# Altium schematic sheet Power.SchDoc
size A3; SheetNumber: 2; SheetTotal: 5
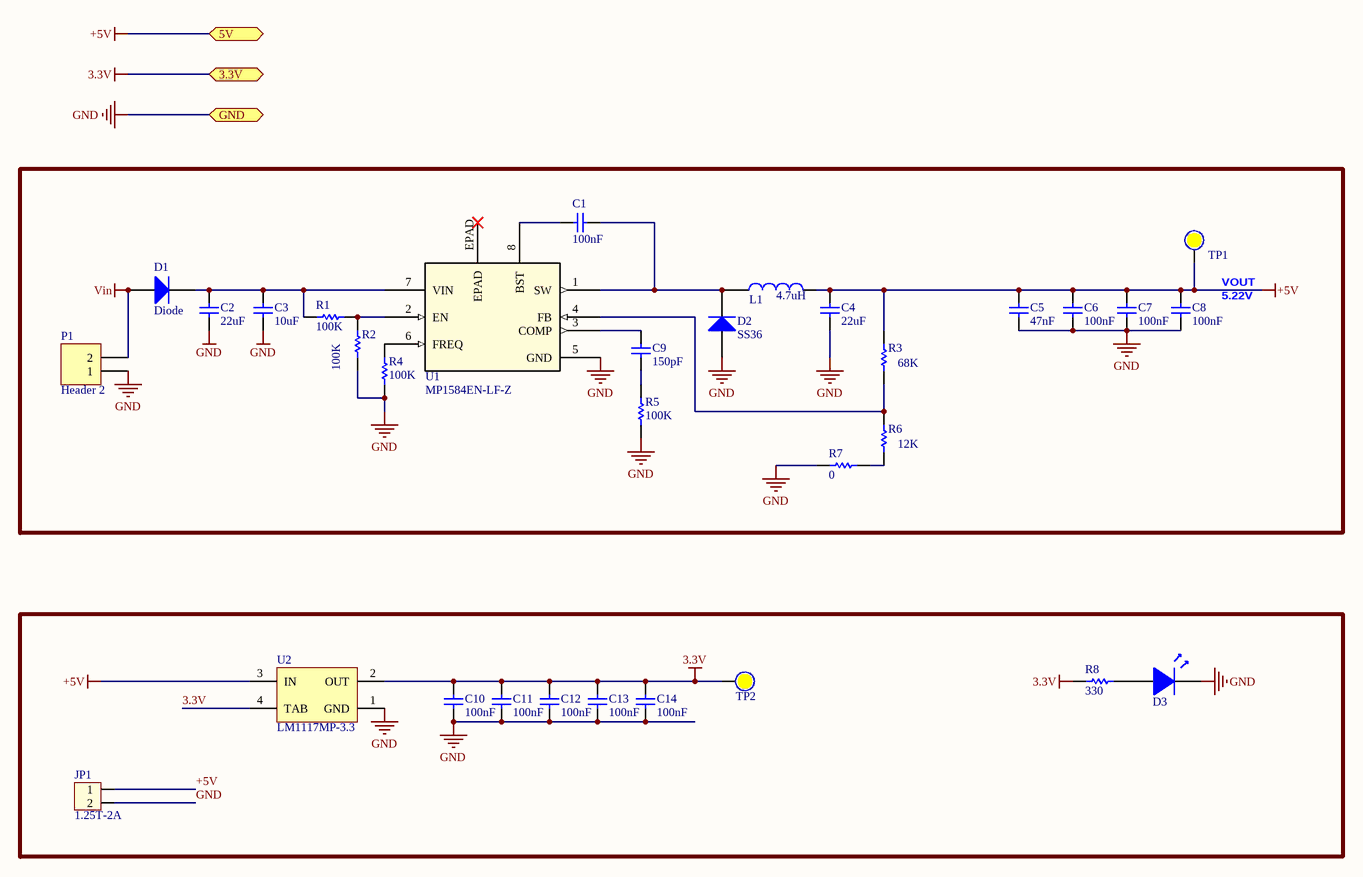
[diagram p0: Power.SchDoc]

## Parts
C1  100nF  [CAPC-0402 (0506)]
C2  22uF  [2012[0805]]
C3  10uF  [2012[0805]]
C4  22uF  [2012[0805]]
C5  47nF  [2012[0805]]
C6  100nF  [CAPC-0402 (0506)]
C7  100nF  [CAPC-0402 (0506)]
C8  100nF  [CAPC-0402 (0506)]
C9  150pF  [1005[0402]]
C10  100nF  [CAPC-0402 (0506)]
C11  100nF  [CAPC-0402 (0506)]
C12  100nF  [CAPC-0402 (0506)]
C13  100nF  [CAPC-0402 (0506)]
C14  100nF  [CAPC-0402 (0506)]
D1  Diode  [DIODE SMD]
D2  SS36  [SMB]
D3  LED  [LED_0603_BLUE]  (value not drawn)
JP1  1.25T-2A  [BM02B-GHS]
L1  4.7uH  [INDUCTOR SMD 7x7]
P1  Header 2  [BM02B-GHS]
R1  100K  [1005[0402]]
R2  100K  [1005[0402]]
R3  68K  [1005[0402]]
R4  100K  [1005[0402]]
R5  100K  [1005[0402]]
R6  12K  [1005[0402]]
R7  0  [1005[0402]]
R8  330  [RESC-0402 (1005)]
TP1  (no value)  [Test Point 1 MM]  (no BOM)
TP2  (no value)  [Test Point 1 MM]  (no BOM)
U1  MP1584EN-LF-Z  [SOIC8E_MPS]
U2  LM1117MP-3.3  [MP04A_N]

## Ports
3.3V (bidir), 5V (bidir), GND (bidir)

## Nets
3.3V: C10.2 C11.2 C12.2 C13.2 C14.2 R8.2 TP2.0 U2.2(OUT) U2.4(TAB) ; port 3.3V
+5V: C4.2 C5.2 C6.2 C7.2 C8.2 JP1.1 L1.2 R3.2 TP1.0 U2.3(IN) ; port 5V
GND: C2.1 C3.1 C4.1 C5.1 C6.1 C7.1 C8.1 C10.1 C11.1 C12.1 C13.1 C14.1 D2.1(A) D3.2(K) JP1.2 P1.1 R2.1 R4.2 R5.2 R7.1 U1.5(GND) U2.1(GND) ; port GND
Vin: D1.1(A) P1.2
NetC1_1: C1.1 D2.2(K) L1.1 U1.1(SW)
NetC1_2: C1.2 U1.8(BST)
NetC2_2: C2.2 C3.2 D1.2(K) R1.2 U1.7(VIN)
NetC9_1: C9.1 R5.1
NetC9_2: C9.2 U1.3(COMP)
NetD3_1: D3.1(A) R8.1
NetR1_1: R1.1 R2.2 U1.2(EN)
NetR3_1: R3.1 R6.1 U1.4(FB)
NetR4_1: R4.1 U1.6(FREQ)
NetR6_2: R6.2 R7.2

Not connected (* = marked no-connect by the designer): U1 EPAD*

## Notes on the sheet
- 5.22V
- VOUT

## Library data of the parts
C1-C14 = TU THUONG
D2 = Diode: Default Diode; Published: 8-Jun-2000; LatestRevisionDate: 17-Jul-2002; LatestRevisionNote: Re-released for DXP Platform.; PackageDocument: Sep-1996; PackageReference: SMC; Publisher: Altium Limited; Code_JEDEC: DO-214-AB
JP1 = Header 1_2.54_2P: Cắm; Chung_Loai: Cắm
L1 = Inductor SMD
P1 = Header 2: Header, 2-Pin; LatestRevisionDate: 17-Jul-2002; LatestRevisionNote: Re-released for DXP Platform.; Publisher: Altium Limited
R1-R7 = Res1: Resistor; Value: 1k; Published: 8-Jun-2000; LatestRevisionDate: 17-Jul-2002; LatestRevisionNote: Re-released for DXP Platform.; PackageReference: AXIAL-0.3; Publisher: Altium Limited; PackageDescription: Axial Device, Thru-Hole; 2 Leads; 0.3 in Pin Spacing
R8 = Res Semi: Semiconductor Resistor; Published: 8-Jun-2000; LatestRevisionDate: 17-Jul-2002; LatestRevisionNote: Re-released for DXP Platform.; PackageReference: AXIAL-0.5; Publisher: Altium Limited; PackageDescription: Axial Device, Thru-Hole; 2 Leads; 0.5 in Pin Spacing; Value: 330
TP1 TP2 = Test Point: Solder: NF
U1 = MP1584EN-LF-Z: No Description Available; Mfr_Name: Monolithic Power Systems; Copyright: Copyright (C) 2023 Ultra Librarian. All rights reserved.; Manufacturer_Part_Number: MP1584EN-LF-Z; RefDes: RefDes; Type: DEV
U2 = LM1117MP-3.3: 800mA Low-Dropout Linear Regulator, 4-pin SOT-223; Manufacturer: National Semiconductor; PackageTopMarking: XYTT*N05A; PowerWise: N; CompType: LDO IC; Published: 4-Dec-2008; DatasheetVersion: Apr-2006; PackageVersion: revB, Apr-2003; PackageReference: MP04A; Publisher: Altium Limited; PackageDescription: Molded SOT-223, 6.50 x 3.56 x 1.6mm Body, 4 Lead, 2.3mm Pitch; Supplier 1: Farnell; Supplier Part Number 1: 9778195; Supplier 2: Farnell; Supplier Part Number 2: 9778195RL; PartNumber: LM1117MP-3.3; RoHS: N; PinCount: 4; Code_JEDEC: TO-261-AA; Code_IPC: SOT223-4; ComponentLink1Description: LM1117 Datasheet; ComponentLink1URL: http://www.national.com/ds/LM/LM1117.pdf; ComponentLink2Description: LM1117 Web Page; ComponentLink2URL: http://www.national.com/pf/LM/LM1117.html; ComponentLink3Description: MP04A Package Page; ComponentLink3URL: http://www.national.com/packaging/folders/mp04a.html